# Altium schematic sheet main.SchDoc
size A; SheetNumber: 1; SheetTotal: 4
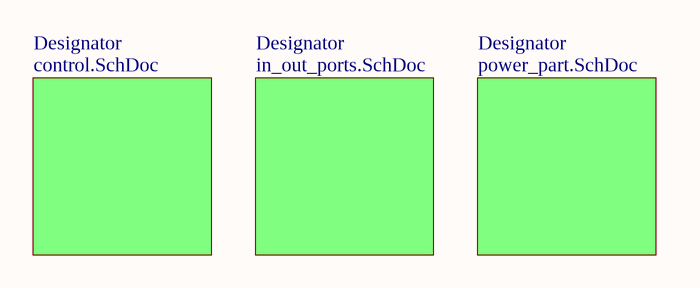
[diagram p0: main.SchDoc]

## Sub-sheets
Designator = control.SchDoc: no entries
Designator = in_out_ports.SchDoc: no entries
Designator = power_part.SchDoc: no entries